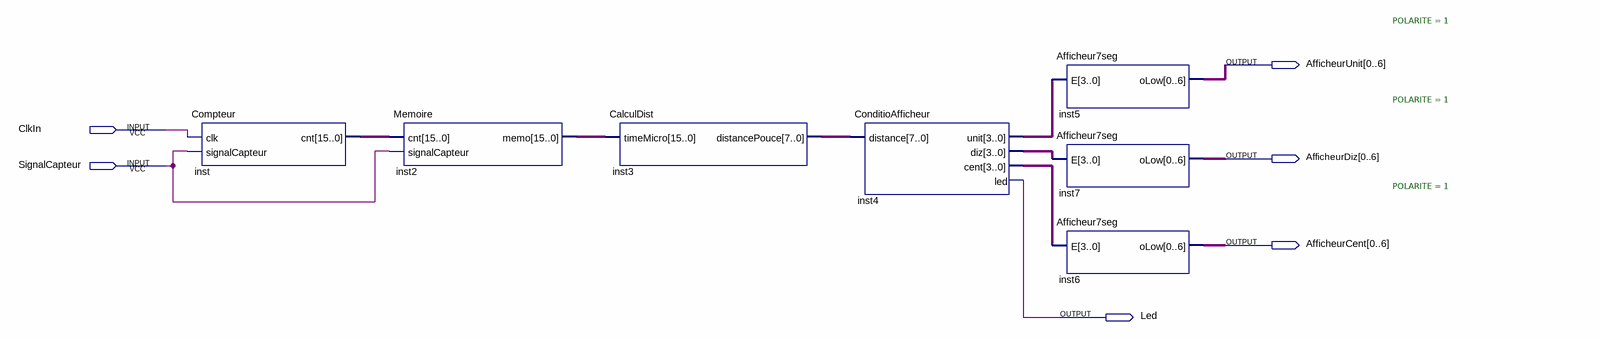
[diagram p0: schematic sheet]
// Quartus schematic Telemetre.bdf as structural Verilog: 7 symbols, 6 pins
module Telemetre (
  input  ClkIn,
  input  SignalCapteur,
  output [0:6] AfficheurUnit,
  output [0:6] AfficheurDiz,
  output [0:6] AfficheurCent,
  output Led
);

  wire [3:0] inst4_cent, inst4_diz, inst4_unit;
  wire [7:0] inst3_distancepouce;
  wire [15:0] inst2_memo, inst_cnt;

  Compteur inst (.clk(ClkIn), .signalCapteur(SignalCapteur), .cnt(inst_cnt));
  Memoire inst2 (.cnt(inst_cnt), .signalCapteur(SignalCapteur), .memo(inst2_memo));
  CalculDist inst3 (.timeMicro(inst2_memo), .distancePouce(inst3_distancepouce));
  ConditioAfficheur inst4 (
    .distance(inst3_distancepouce), .unit(inst4_unit), .diz(inst4_diz), .cent(inst4_cent), .led(Led));
  Afficheur7seg #(.POLARITE(1)) inst5 (.E(inst4_unit), .oLow(AfficheurUnit));
  Afficheur7seg #(.POLARITE(1)) inst7 (.E(inst4_diz), .oLow(AfficheurDiz));
  Afficheur7seg #(.POLARITE(1)) inst6 (.E(inst4_cent), .oLow(AfficheurCent));
endmodule
